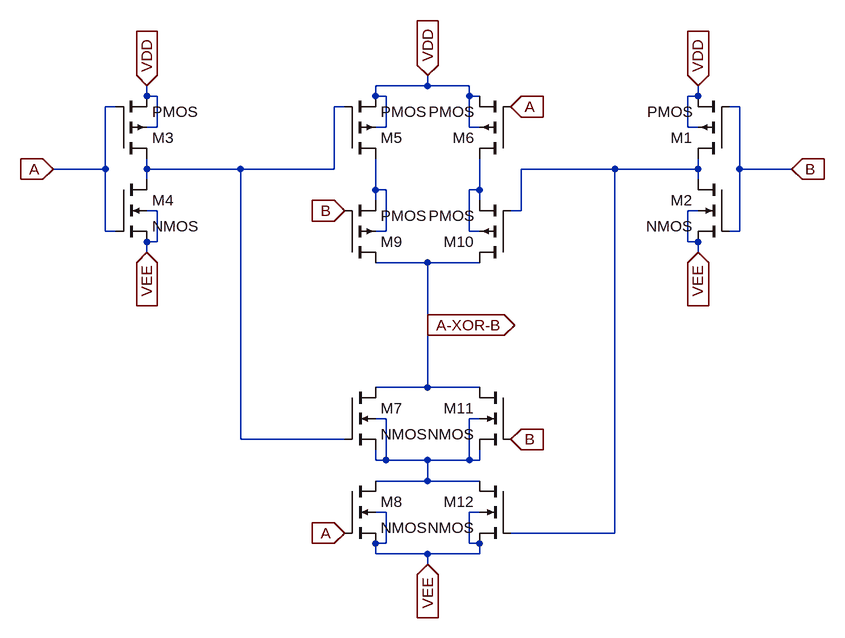
[diagram p0: schematic 2_Input_XOR_Gate_Symbol.asc]
2_Input_XOR_Gate_Symbol.asc, the LTspice schematic file:
Version 4
SHEET 1 1032 904
WIRE 400 80 400 64
WIRE 400 80 320 80
WIRE 464 80 400 80
WIRE -32 96 -32 80
WIRE -16 96 -32 96
WIRE 320 96 320 80
WIRE 336 96 320 96
WIRE 464 96 464 80
WIRE 480 96 464 96
WIRE 816 96 816 80
WIRE 816 96 800 96
WIRE -80 112 -96 112
WIRE 272 112 256 112
WIRE 880 112 864 112
WIRE -16 144 -16 96
WIRE -16 144 -32 144
WIRE 336 144 336 96
WIRE 336 144 320 144
WIRE 464 144 464 96
WIRE 480 144 464 144
WIRE 800 144 800 96
WIRE 816 144 800 144
WIRE -96 208 -96 112
WIRE -96 208 -176 208
WIRE -32 208 -32 192
WIRE 112 208 -32 208
WIRE 256 208 256 112
WIRE 256 208 112 208
WIRE 688 208 544 208
WIRE 816 208 816 192
WIRE 816 208 688 208
WIRE 880 208 880 112
WIRE 960 208 880 208
WIRE -32 224 -32 208
WIRE 816 224 816 208
WIRE 320 240 320 192
WIRE 336 240 320 240
WIRE 480 240 480 192
WIRE 480 240 464 240
WIRE 320 256 320 240
WIRE 480 256 480 240
WIRE -16 272 -32 272
WIRE 544 272 544 208
WIRE 544 272 528 272
WIRE 816 272 800 272
WIRE -96 304 -96 208
WIRE -80 304 -96 304
WIRE 336 304 336 240
WIRE 336 304 320 304
WIRE 464 304 464 240
WIRE 480 304 464 304
WIRE 880 304 880 208
WIRE 880 304 864 304
WIRE -16 320 -16 272
WIRE -16 320 -32 320
WIRE 800 320 800 272
WIRE 816 320 800 320
WIRE -32 336 -32 320
WIRE 816 336 816 320
WIRE 400 352 320 352
WIRE 480 352 400 352
WIRE 400 448 400 352
WIRE 400 544 400 448
WIRE 400 544 320 544
WIRE 480 544 400 544
WIRE 336 592 320 592
WIRE 480 592 464 592
WIRE 112 624 112 208
WIRE 272 624 112 624
WIRE 320 656 320 640
WIRE 336 656 336 592
WIRE 336 656 320 656
WIRE 400 656 336 656
WIRE 464 656 464 592
WIRE 464 656 400 656
WIRE 480 656 480 640
WIRE 480 656 464 656
WIRE 400 688 400 656
WIRE 400 688 320 688
WIRE 480 688 400 688
WIRE 336 736 320 736
WIRE 480 736 464 736
WIRE 688 768 688 208
WIRE 688 768 528 768
WIRE 336 784 336 736
WIRE 336 784 320 784
WIRE 464 784 464 736
WIRE 480 784 464 784
WIRE 320 800 320 784
WIRE 400 800 320 800
WIRE 480 800 480 784
WIRE 480 800 400 800
WIRE 400 816 400 800
FLAG 816 80 VDD
IOPIN 816 80 In
FLAG 816 336 VEE
IOPIN 816 336 In
FLAG -32 80 VDD
IOPIN -32 80 In
FLAG -32 336 VEE
IOPIN -32 336 In
FLAG -176 208 A
IOPIN -176 208 In
FLAG 960 208 B
IOPIN 960 208 In
FLAG 400 64 VDD
IOPIN 400 64 In
FLAG 528 624 B
IOPIN 528 624 In
FLAG 272 272 B
IOPIN 272 272 In
FLAG 528 112 A
IOPIN 528 112 In
FLAG 272 768 A
IOPIN 272 768 In
FLAG 400 816 VEE
IOPIN 400 816 In
FLAG 400 448 A-XOR-B
IOPIN 400 448 Out
SYMBOL pmos4 864 192 R180
SYMATTR InstName M1
SYMBOL nmos4 864 224 M0
SYMATTR InstName M2
SYMBOL pmos4 -80 192 M180
SYMATTR InstName M3
SYMBOL nmos4 -80 224 R0
SYMATTR InstName M4
SYMBOL pmos4 272 192 M180
SYMATTR InstName M5
SYMBOL pmos4 528 192 R180
SYMATTR InstName M6
SYMBOL nmos4 272 544 R0
SYMATTR InstName M7
SYMBOL nmos4 272 688 R0
SYMATTR InstName M8
SYMBOL pmos4 272 352 M180
SYMATTR InstName M9
SYMBOL pmos4 528 352 R180
SYMATTR InstName M10
SYMBOL nmos4 528 544 M0
SYMATTR InstName M11
SYMBOL nmos4 528 688 M0
SYMATTR InstName M12

The netlist it stands for:
* 2_Input_XOR_Gate_Symbol.asc
M1 N002 B VDD VDD PMOS
M2 N002 B VEE VEE NMOS
M3 N001 A VDD VDD PMOS
M4 N001 A VEE VEE NMOS
M5 N003 N001 VDD VDD PMOS
M6 N004 A VDD VDD PMOS
M7 A-XOR-B N001 N005 N005 NMOS
M8 N005 A VEE VEE NMOS
M9 A-XOR-B B N003 N003 PMOS
M10 A-XOR-B N002 N004 N004 PMOS
M11 A-XOR-B B N005 N005 NMOS
M12 N005 N002 VEE VEE NMOS
.model NMOS NMOS
.model PMOS PMOS
.lib standard.mos
.backanno
.end